# EAGLE schematic dlp.vco.dualosc.v1.1.pnl (EAGLE 7.2.0)
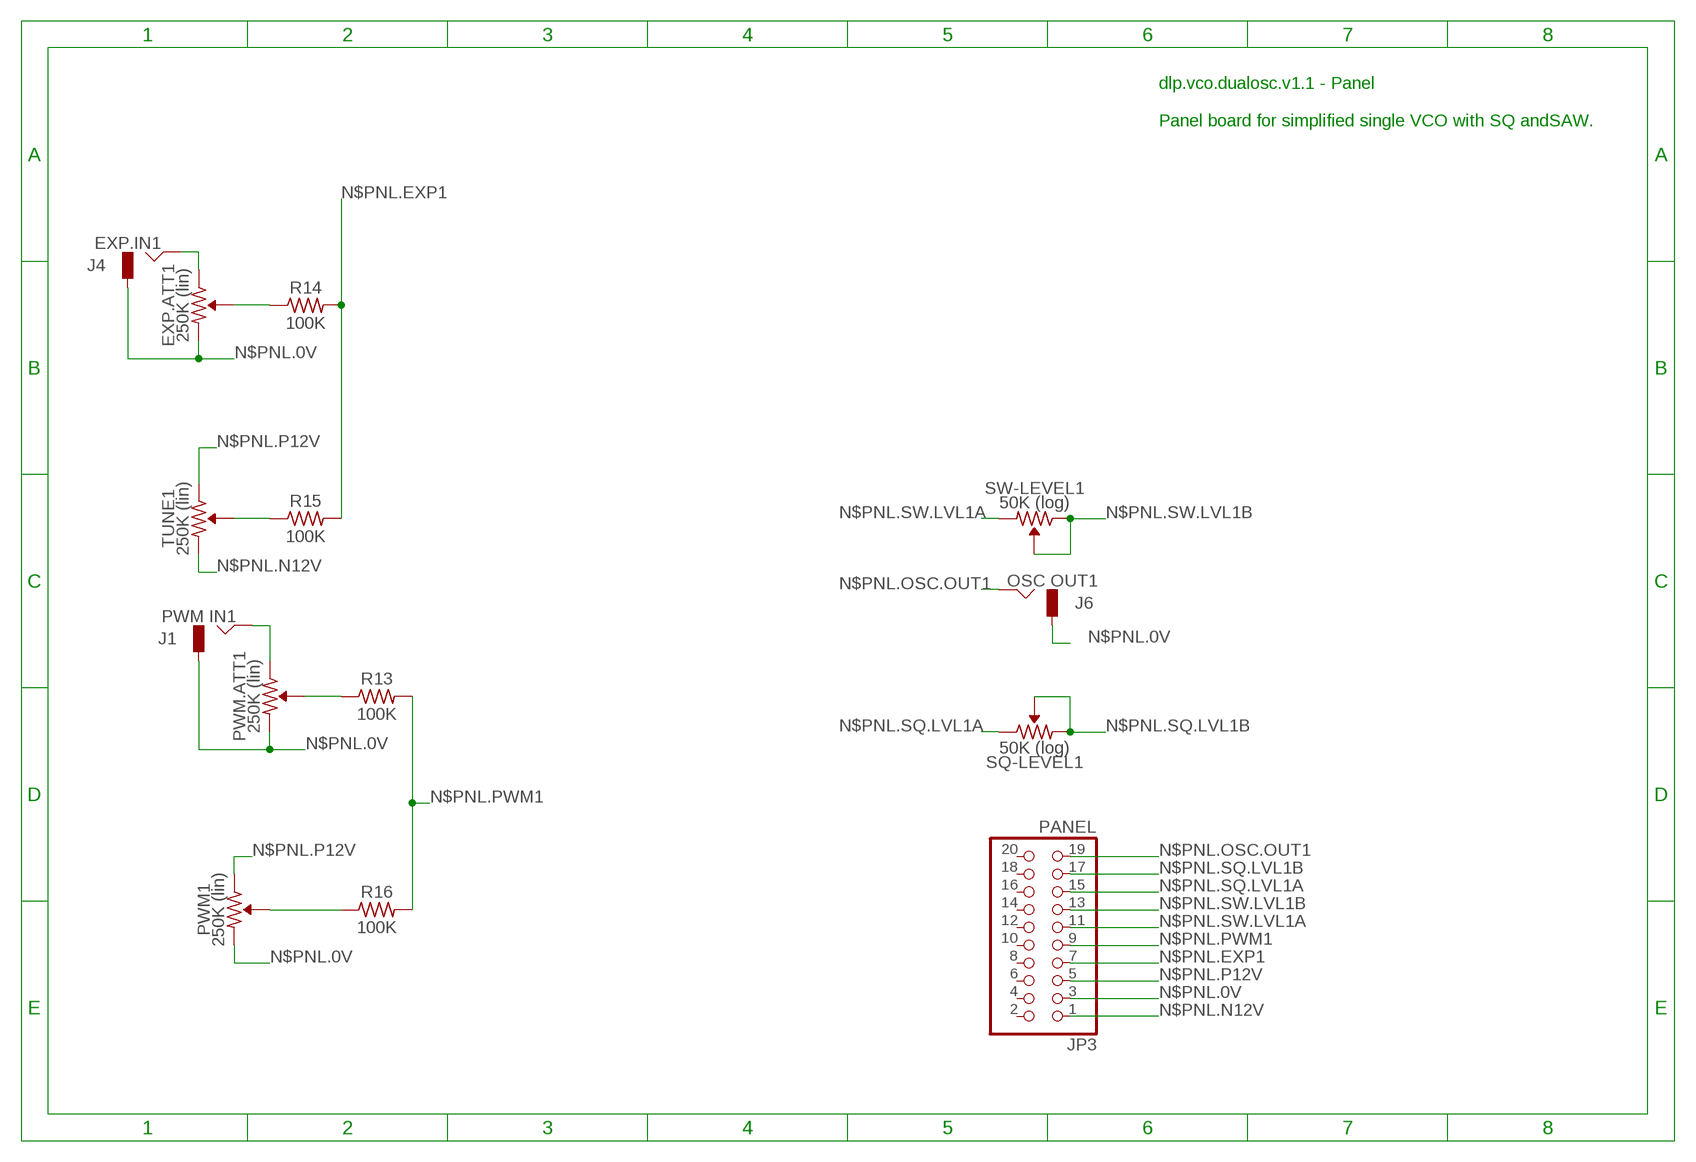
[diagram p0: schematic, sheet 1]

## Parts
EXP.ATT1  250K (lin)  R-VAR  [R-VAR]
J1  PWM IN1  JACK-M  [JACK-M]
J4  EXP.IN1  JACK-M  [JACK-M]
J6  OSC OUT1  JACK-M  [JACK-M]
JP3  PANEL  PINHD-2X10  [2X10]
PWM1  250K (lin)  R-VAR  [R-VAR]
PWM.ATT1  250K (lin)  R-VAR  [R-VAR]
R13  100K  R0309/10  [0309/10]
R14  100K  R0309/10  [0309/10]
R15  100K  R0309/10  [0309/10]
R16  100K  R0309/10  [0309/10]
SQ-LEVEL1  50K (log)  R-VAR  [R-VAR]
SW-LEVEL1  50K (log)  R-VAR  [R-VAR]
TUNE1  250K (lin)  R-VAR  [R-VAR]

## Nets
N$10: PWM.ATT1.VAR R13.1
N$19: PWM1.VAR R16.1
N$23: EXP.ATT1.VAR R14.1
N$24: R15.1 TUNE1.VAR
N$25: J1.HOT PWM.ATT1.R1
N$26: EXP.ATT1.R1 J4.HOT
N$PNL.0V: EXP.ATT1.R2 J1.GND J4.GND J6.GND JP3.3 PWM1.R2 PWM.ATT1.R2
N$PNL.EXP1: JP3.7 R14.2 R15.2
N$PNL.N12V: JP3.1 TUNE1.R2
N$PNL.OSC.OUT1: J6.HOT JP3.19
N$PNL.P12V: JP3.5 PWM1.R1 TUNE1.R1
N$PNL.PWM1: JP3.9 R13.2 R16.2
N$PNL.SQ.LVL1A: JP3.15 SQ-LEVEL1.R1
N$PNL.SQ.LVL1B: JP3.17 SQ-LEVEL1.R2 SQ-LEVEL1.VAR
N$PNL.SW.LVL1A: JP3.11 SW-LEVEL1.R2
N$PNL.SW.LVL1B: JP3.13 SW-LEVEL1.R1 SW-LEVEL1.VAR
Unconnected: JP3.2 JP3.4 JP3.6 JP3.8 JP3.10 JP3.12 JP3.14 JP3.16 JP3.18 JP3.20

## Notes on the sheet
- dlp.vco.dualosc.v1.1 - Panel
  
  Panel board for simplified single VCO with SQ andSAW.

## Library data of the parts
EXP.ATT1 PWM1 PWM.ATT1 SQ-LEVEL1 SW-LEVEL1 TUNE1 = _common:R-VAR
J1 J4 J6 = _common:JACK-M
JP3 = pinhead:PINHD-2X10: PIN HEADER
R13-R16 = _common:R: RESISTOR, US symbol